# EAGLE design Solar board (EAGLE 9.6.2)
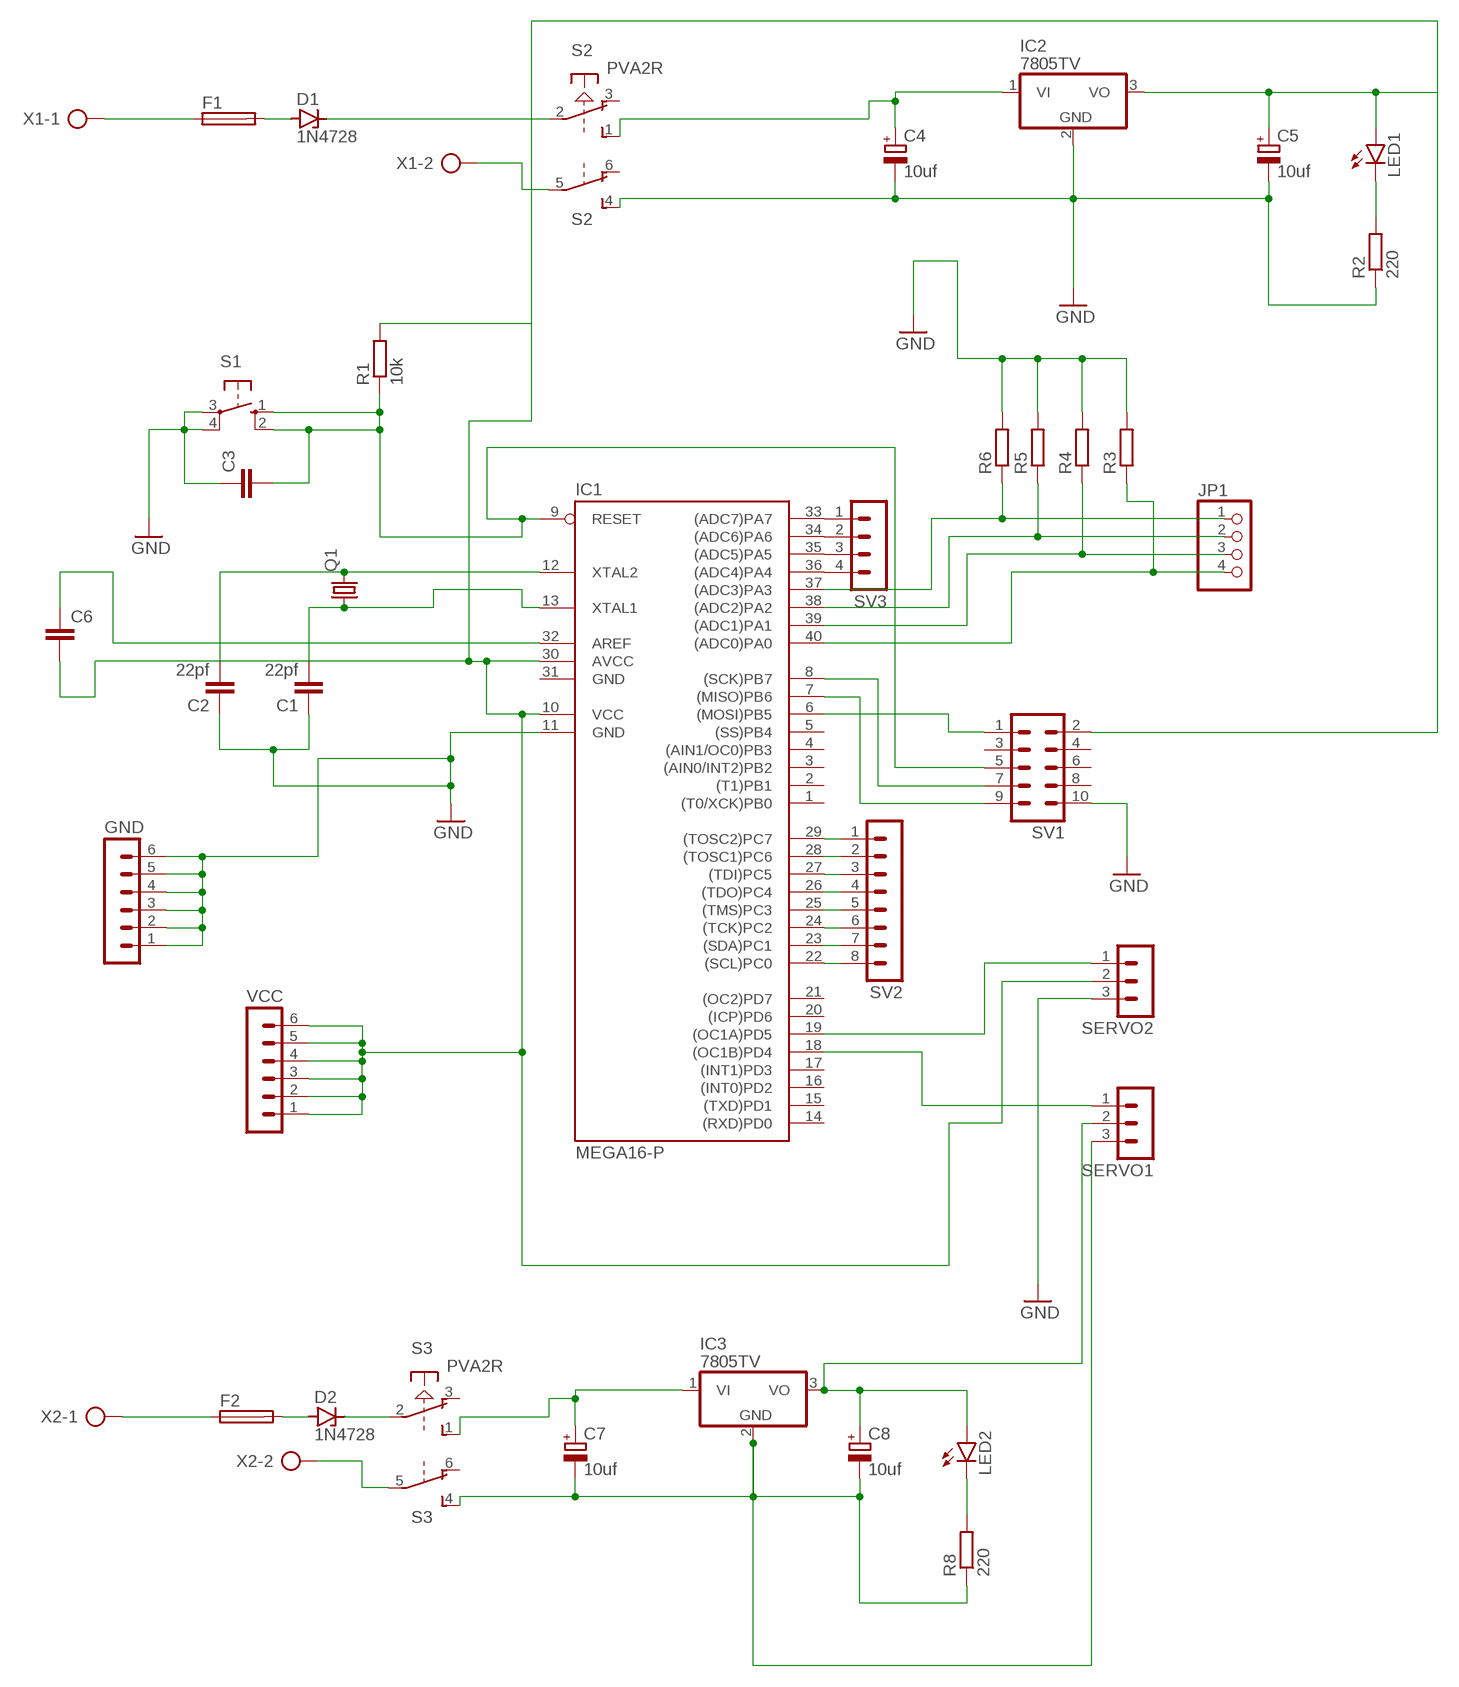
[diagram p0: schematic, sheet 1]

## Parts
C1  22pf  C-EU025-025X050  [C025-025X050]
C2  22pf  C-EU025-025X050  [C025-025X050]
C3  C-EU025-025X050  [C025-025X050]
C4  10uf  CPOL-EUE2.5-6  [E2,5-6]
C5  10uf  CPOL-EUE2.5-6  [E2,5-6]
C6  C-EU025-025X050  [C025-025X050]
C7  10uf  CPOL-EUE2.5-6  [E2,5-6]
C8  10uf  CPOL-EUE2.5-6  [E2,5-6]
D1  1N4728  [DO41Z10]
D2  1N4728  [DO41Z10]
F1  GSH15  [GSH15]
F2  GSH15  [GSH15]
GND  MA06-1  [MA06-1]
IC1  MEGA16-P  [DIL40]
IC2  7805TV  [TO220V]
IC3  7805TV  [TO220V]
JP1  PINHD-1X4  [1X04]
LED1  LED5MM  [LED5MM]
LED2  LED5MM  [LED5MM]
Q1  CRYSTALHC49U70  [HC49U70]
R1  10k  R-EU_0207/10  [0207/10]
R2  220  R-EU_0207/10  [0207/10]
R3  R-EU_0207/10  [0207/10]
R4  R-EU_0207/10  [0207/10]
R5  R-EU_0207/10  [0207/10]
R6  R-EU_0207/10  [0207/10]
R8  220  R-EU_0207/10  [0207/10]
S1  10-XX  [B3F-10XX]
S2  PVA2R  [PVA2R]
S3  PVA2R  [PVA2R]
SERVO1  MA03-1  [MA03-1]
SERVO2  MA03-1  [MA03-1]
SV1  MA05-2  [MA05-2]
SV2  MA08-1W  [MA08-1W]
SV3  MA04-1  [MA04-1]
VCC  MA06-1  [MA06-1]
X1  AK500/2  [AK500/2]
X2  AK500/2  [AK500/2]

## Nets
GND: C1.1 C2.1 C3.1 C4.- C5.- GND.1 GND.2 GND.3 GND.4 GND.5 GND.6 IC1.11(GND) IC2.2(GND) R2.1 R3.2 R4.2 R5.2 R6.2 S1.3(P) S1.4(P1) S2.4(2:S) SERVO2.3 SV1.10
N$1: C1.2 IC1.13(XTAL1) Q1.1
N$2: C2.2 IC1.12(XTAL2) Q1.2
N$3: IC1.6((MOSI)PB5) SV1.1
N$4: IC1.7((MISO)PB6) SV1.9
N$5: IC1.8((SCK)PB7) SV1.7
N$6: C4.+ IC2.1(VI) S2.1(1:S)
N$7: IC1.18((OC1B)PD4) SERVO1.1
N$8: C3.2 IC1.9(RESET) R1.1 S1.1(S) S1.2(S1) SV1.5
N$9: LED1.K(C) R2.2
N$10: IC1.37((ADC3)PA3) JP1.1 R6.1
N$11: IC1.38((ADC2)PA2) JP1.2 R5.1
N$12: IC1.39((ADC1)PA1) JP1.3 R4.1
N$13: IC1.40((ADC0)PA0) JP1.4 R3.1
N$14: IC1.19((OC1A)PD5) SERVO2.1
N$15: D1.A F1.2
N$16: F1.1 X1.1
N$17: D1.C S2.2(1:P)
N$18: LED2.K(C) R8.2
N$19: S2.5(2:P) X1.2
N$20: IC1.29((TOSC2)PC7) SV2.1
N$21: IC1.28((TOSC1)PC6) SV2.2
N$22: IC1.27((TDI)PC5) SV2.3
N$23: IC1.26((TDO)PC4) SV2.4
N$24: IC1.25((TMS)PC3) SV2.5
N$25: IC1.24((TCK)PC2) SV2.6
N$26: IC1.23((SDA)PC1) SV2.7
N$27: IC1.22((SCL)PC0) SV2.8
N$28: IC1.33((ADC7)PA7) SV3.1
N$29: IC1.34((ADC6)PA6) SV3.2
N$30: IC1.35((ADC5)PA5) SV3.3
N$31: IC1.36((ADC4)PA4) SV3.4
N$32: C7.+ IC3.1(VI) S3.1(1:S)
N$33: C6.1 IC1.32(AREF)
N$34: C8.+ IC3.3(VO) LED2.A SERVO1.2
N$35: S3.5(2:P) X2.2
N$37: D2.A F2.2
N$38: F2.1 X2.1
N$39: D2.C S3.2(1:P)
N$40: C7.- C8.- IC3.2(GND) R8.1 S3.4(2:S) SERVO1.3
N$41: C5.+ C6.2 IC1.10(VCC) IC1.30(AVCC) IC2.3(VO) LED1.A R1.2 SERVO2.2 SV1.2 VCC.1 VCC.2 VCC.3 VCC.4 VCC.5 VCC.6
Unconnected: IC1.1((T0/XCK)PB0) IC1.2((T1)PB1) IC1.3((AIN0/INT2)PB2) IC1.4((AIN1/OC0)PB3) IC1.5((SS)PB4) IC1.14((RXD)PD0) IC1.15((TXD)PD1) IC1.16((INT0)PD2) IC1.17((INT1)PD3) IC1.20((ICP)PD6) IC1.21((OC2)PD7) S2.3(1:O) S2.6(2:O) S3.3(1:O) S3.6(2:O) SV1.3 SV1.4 SV1.6 SV1.8

## Power pins joined to a net without a drawn wire
GND: IC1.31(GND)

## Library data of the parts
C1-C3 C6 = rcl:C-EU: CAPACITOR, European symbol; SPICEPREFIX: C
C4 C5 C7 C8 = rcl:CPOL-EU: POLARIZED CAPACITOR, European symbol; SPICEPREFIX: C
D1 D2 = diode:1N4728: Z DIODE 3.3 V, 1W, 5 percent
F1 F2 = fuse:GSH15: FUSE HOLDER grid 15mm, 19649 Wickmann; MPN: 64900001039; OC_FARNELL: 1271673; OC_NEWARK: 02P0318
GND VCC = con-lstb:MA06-1: PIN HEADER; OC_FARNELL: unknown; OC_NEWARK: unknown
IC1 = atmel:MEGA16-P: MICROCONTROLLER 16 Kbytes FLASH 1 kbytes SRAM 512 bytes EEPROM USART 8-channel 10 bit ADC Source: avr.lbr; MPN: ATMEGA16-16PU; OC_FARNELL: 9171142; OC_NEWARK: 01M6885
IC2 IC3 = linear:78*: Positive VOLTAGE REGULATOR Source: http://cache.national.com/ds/LM/LM78L05.pdf http://www.fairchildsemi.com/ds/LM/LM7805.pdf
JP1 = pinhead:PINHD-1X4: PIN HEADER
LED1 LED2 = led:LED: LED OSRAM: - CHIPLED LG R971, LG N971, LY N971, LG Q971, LY Q971, LO R971, LY R971 LH N974, LH R974 LS Q976, LO Q976, LY Q976 LO Q996 - Hyper CHIPLED LW Q18S LB Q993, LB Q99A, LB R99A - SideLED LS A670, LO A670, LY A670, LG A670, LP A670 LB A673, LV A673, LT A673, LW A673 LH A674 LY A675 LS A676, LA A676, LO A676, LY A676, LW A676 LS A679, LY A679, LG A679 - Hyper Micro SIDELED® LS Y876, LA Y876, LO Y876, LY Y876 LT Y87S - SmartLED LW L88C, LW L88S LB L89C, LB L89S, LG L890 LS L89K, LO L89K, LY L89K LS L896, LA L896, LO L896, LY L896 - TOPLED LS T670, LO T670, LY T670, LG T670, LP T670 LSG T670, LSP T670, LSY T670, LOP T670, LYG T670 LG T671, LOG T671, LSG T671 LB T673, LV T673, LT T673, LW T673 LH T674 LS T676, LA T676, LO T676, LY T676, LB T676, LH T676, LSB T676, LW T676 LB T67C, LV T67C, LT T67C, LS T67K, LO T67K, LY T67K, LW E67C LS E67B, LA E67B, LO E67B, LY E67B, LB E67C, LV E67C, LT E67C LW T67C LS T679, LY T679, LG T679 LS T770, LO T770, LY T770, LG T770, LP T770 LB T773, LV T773, LT T773, LW T773 LH T774 LS E675, LA E675, LY E675, LS T675 LS T776, LA T776, LO T776, LY T776, LB T776 LHGB T686 LT T68C, LB T68C - Hyper Mini TOPLED® LB M676 - Mini TOPLED Santana® LG M470 LS M47K, LO M47K, LY M47K Source: http://www.osram.convergy.de LUXEON: - LUMILED® LXK2-PW12-R00, LXK2-PW12-S00, LXK2-PW14-U00, LXK2-PW14-V00 LXK2-PM12-R00, LXK2-PM12-S00, LXK2-PM14-U00 LXK2-PE12-Q00, LXK2-PE12-R00, LXK2-PE12-S00, LXK2-PE14-T00, LXK2-PE14-U00 LXK2-PB12-K00, LXK2-PB12-L00, LXK2-PB12-M00, LXK2-PB14-N00, LXK2-PB14-P00, LXK2-PB14-Q00 LXK2-PR12-L00, LXK2-PR12-M00, LXK2-PR14-Q00, LXK2-PR14-R00 LXK2-PD12-Q00, LXK2-PD12-R00, LXK2-PD12-S00 LXK2-PH12-R00, LXK2-PH12-S00 LXK2-PL12-P00, LXK2-PL12-Q00, LXK2-PL12-R00 Source: www.luxeon.com KINGBRIGHT: KA-3528ASYC Source: www.kingbright.com
Q1 = crystal:CRYSTAL: CRYSTAL; OC_FARNELL: unknown; OC_NEWARK: unknown
R1-R6 R8 = rcl:R-EU_: RESISTOR, European symbol; SPICEPREFIX: R
S1 = switch-omron:10-XX: OMRON SWITCH; MPN: B3F-1000; OC_FARNELL: 176432; OC_NEWARK: 36M3542
S2 S3 = switch-misc:PVA2R: ITT SWITCH
SERVO1 SERVO2 = con-lstb:MA03-1: PIN HEADER; OC_FARNELL: unknown; OC_NEWARK: unknown
SV1 = con-lstb:MA05-2: PIN HEADER; OC_FARNELL: unknown; OC_NEWARK: unknown
SV2 = con-lstb:MA08-1W: PIN HEADER; OC_FARNELL: unknown; OC_NEWARK: unknown
SV3 = con-lstb:MA04-1: PIN HEADER; OC_FARNELL: unknown; OC_NEWARK: unknown
X1 X2 = con-ptr500:AK500/2: CONNECTOR; OC_FARNELL: unknown; OC_NEWARK: unknown

## Board
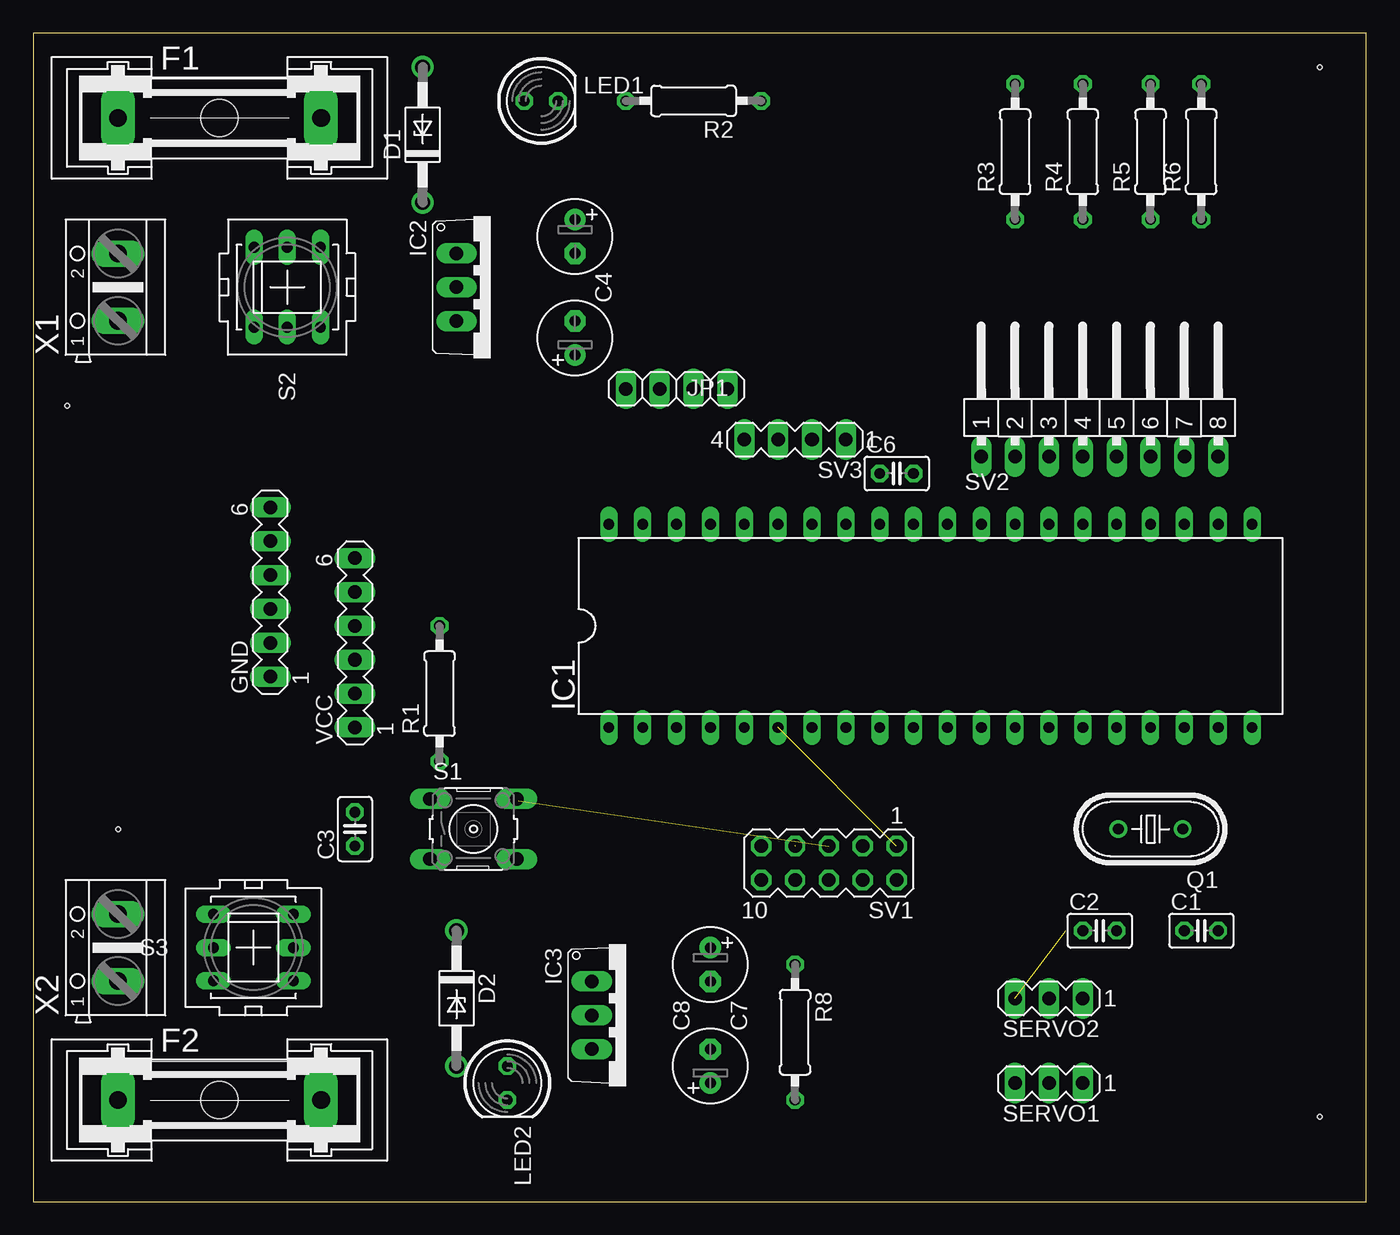
[diagram p1: board, top side]
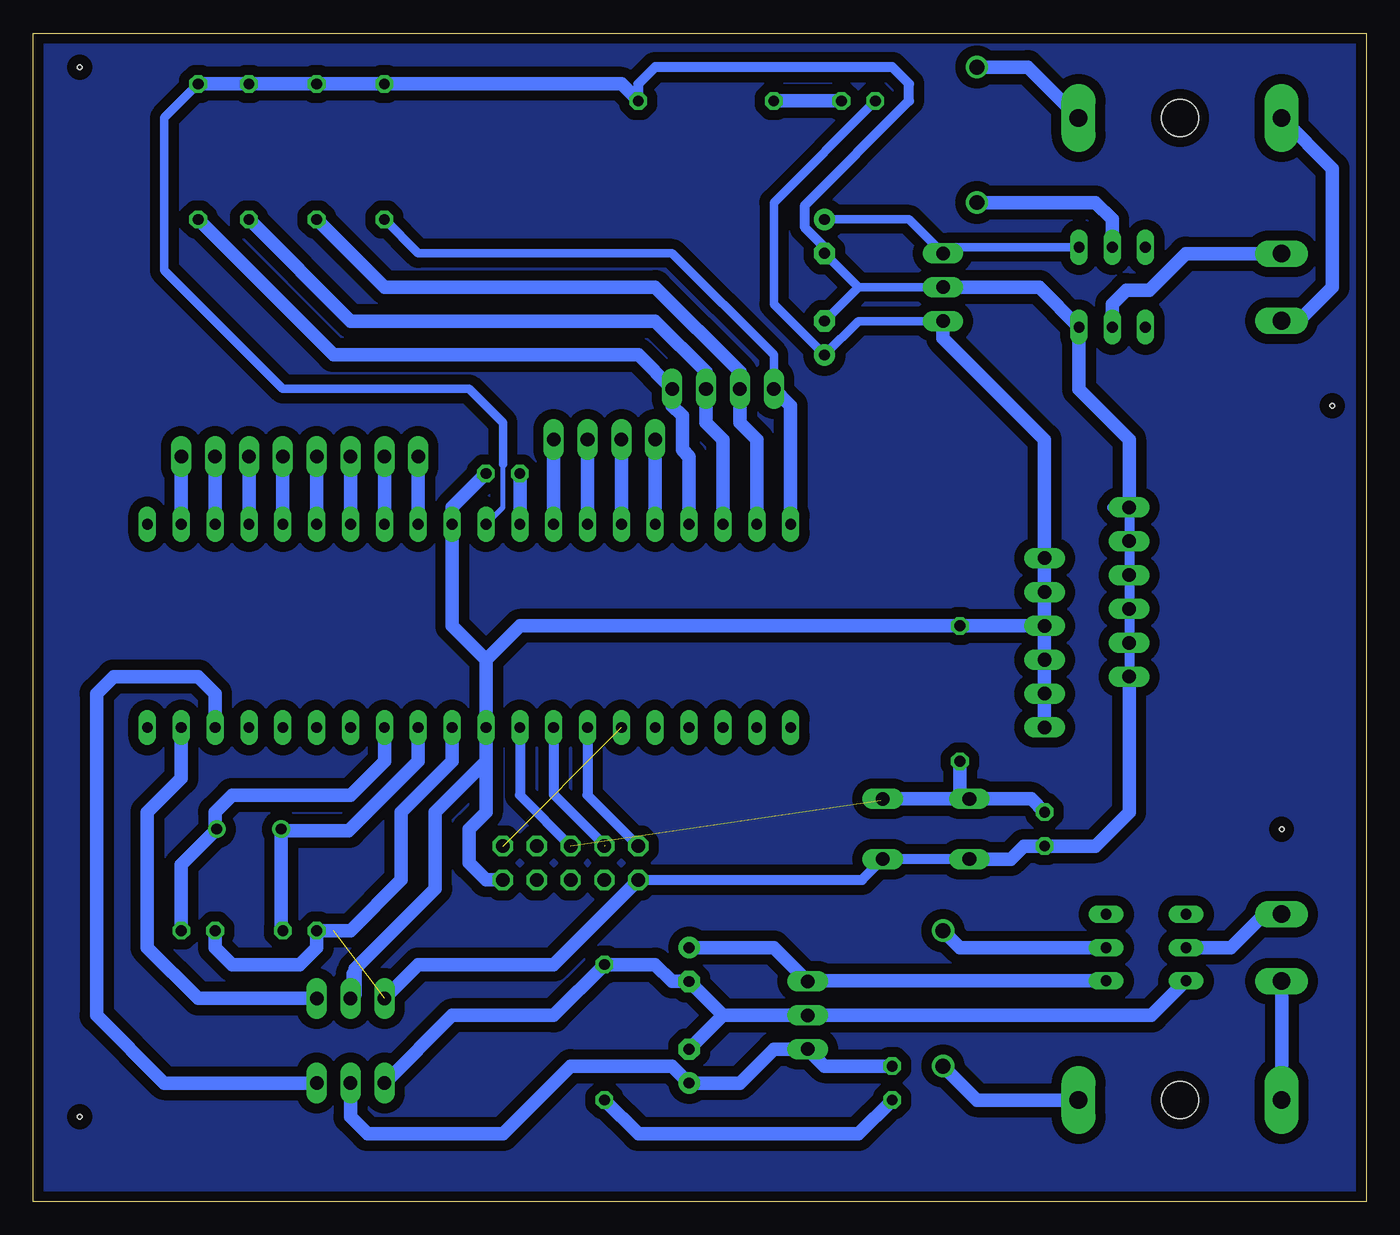
[diagram p2: board, bottom side, seen from below]

Size 100 x 87.62 mm. Coordinates in mm from the lower left corner, seen from the top.
Outline: 0,0 100,0 100,87.62 0,87.62 0,0
Copper layers (1*16): Top 0.035mm / dielectric 1.5mm / Bottom 0.035mm
Design rules "default *": minimum track width 40mil, minimum drill 0.35mm, track to track 30mil, track to pad 30mil, pad to pad 20mil, via to via 6mil, smd to smd 6mil, copper to edge 30mil, drill to drill 10mil, minimum pad ring 10mil, minimum via ring 8mil, stop-mask expansion 4mil, vias tented up to drill 0mil, thermal gap 10mil
Holes 0.35 mm at 96.52,85.09 2.54,59.69 6.35,27.94 96.52,6.35

### Footprints (pad centres in the part's own frame; a part is rotated, then mirrored left to right if it is on the bottom)
C025-025X050 = drill 0.813 octagon: 1 -1.27,0; 2 1.27,0
E2,5-6 = drill 0.813 pad 1.6: + -1.27,0 | drill 0.813 pad 1.6 octagon: - 1.27,0
DO41Z10 = drill 1.118: A 5.08,0; C -5.08,0
GSH15 = drill 1.321 pad 2.54 long: 1 -7.62,0; 2 7.62,0 | hole 2.794: 0,0
MA06-1 = drill 1.016 long: 1 -6.35,0; 2 -3.81,0; 3 -1.27,0; 4 1.27,0; 5 3.81,0; 6 6.35,0
DIL40 = drill 0.813 long: 1 -24.13,-7.62; 2 -21.59,-7.62; 3 -19.05,-7.62; 4 -16.51,-7.62; 5 -13.97,-7.62; 6 -11.43,-7.62; 7 -8.89,-7.62; 8 -6.35,-7.62; 9 -3.81,-7.62; 10 -1.27,-7.62; 11 1.27,-7.62; 12 3.81,-7.62; 13 6.35,-7.62; 14 8.89,-7.62; 15 11.43,-7.62; 16 13.97,-7.62; 17 16.51,-7.62; 18 19.05,-7.62; 19 21.59,-7.62; 20 24.13,-7.62; 21 24.13,7.62; 22 21.59,7.62; 23 19.05,7.62; 24 16.51,7.62; 25 13.97,7.62; 26 11.43,7.62; 27 8.89,7.62; 28 6.35,7.62; 29 3.81,7.62; 30 1.27,7.62; 31 -1.27,7.62; 32 -3.81,7.62; 33 -6.35,7.62; 34 -8.89,7.62; 35 -11.43,7.62; 36 -13.97,7.62; 37 -16.51,7.62; 38 -19.05,7.62; 39 -21.59,7.62; 40 -24.13,7.62
TO220V = drill 1.016 long: 1 -2.54,-2.54; 2 0,-2.54; 3 2.54,-2.54
1X04 = drill 1.016 long: 1 -3.81,0; 2 -1.27,0; 3 1.27,0; 4 3.81,0
LED5MM = drill 0.813 octagon: A -1.27,0; K 1.27,0
HC49U70 = drill 0.813: 1 -2.413,0; 2 2.413,0
0207/10 = drill 0.813 octagon: 1 -5.08,0; 2 5.08,0
B3F-10XX = drill 1.016 long: 1 -3.251,2.261; 2 3.251,2.261; 3 -3.251,-2.261; 4 3.251,-2.261
PVA2R = drill 0.813 long: 1 -2.997,2.489; 2 -2.997,0; 3 -2.997,-2.489; 4 2.997,2.489; 5 2.997,0; 6 2.997,-2.489
MA03-1 = drill 1.016 long: 1 -2.54,0; 2 0,0; 3 2.54,0
MA05-2 = drill 1.016 octagon: 1 -5.08,-1.27; 2 -5.08,1.27; 3 -2.54,-1.27; 4 -2.54,1.27; 5 0,-1.27; 6 0,1.27; 7 2.54,-1.27; 8 2.54,1.27; 9 5.08,-1.27; 10 5.08,1.27
MA08-1W = drill 1.016 long: 1 -8.89,0; 2 -6.35,0; 3 -3.81,0; 4 -1.27,0; 5 1.27,0; 6 3.81,0; 7 6.35,0; 8 8.89,0
MA04-1 = drill 1.016 long: 1 -3.81,0; 2 -1.27,0; 3 1.27,0; 4 3.81,0
AK500/2 = drill 1.321 long: 1 -2.515,0; 2 2.515,0

### Placement (x,y rotation side)
C1  87.63,20.32 0 top
C2  80.01,20.32 0 top
C3  24.13,27.94 90 top
C4  40.64,72.39 270 top
C5  40.64,64.77 90 top
C6  64.77,54.61 0 top
C7  50.8,17.78 270 top
C8  50.8,10.16 90 top
D1  29.21,80.01 90 top
D2  31.75,15.24 270 top
F1  13.97,81.28 0 top
F2  13.97,7.62 0 top
GND  17.78,45.72 90 top
IC1  67.31,43.18 0 top
IC2  34.29,68.58 270 top
IC3  44.45,13.97 270 top
JP1  48.26,60.96 180 top
LED1  38.1,82.55 0 top
LED2  35.56,8.89 270 top
Q1  83.82,27.94 180 top
R1  30.48,38.1 90 top
R2  49.53,82.55 180 top
R3  73.66,78.74 90 top
R4  78.74,78.74 90 top
R5  83.82,78.74 90 top
R6  87.63,78.74 90 top
R8  57.15,12.7 270 top
S1  33.02,27.94 0 top
S2  19.05,68.58 270 top
S3  16.51,19.05 180 top
SERVO1  76.2,8.89 180 top
SERVO2  76.2,15.24 180 top
SV1  59.69,25.4 180 top
SV2  80.01,55.88 0 top
SV3  57.15,57.15 180 top
VCC  24.13,41.91 90 top
X1  6.35,68.58 90 top
X2  6.35,19.05 90 top

### Tracks (layer width: path | path; a pad name or v marks a point on that pad's centre or on a via)
22
  pour Bottom: 0,0 100.33,0 100.33,87.63 0,87.63
GND  (1 unrouted)
  Bottom 0.254: GND.6 GND.5 GND.4 GND.3 GND.2 GND.1
  Bottom 0.381: IC1.31 64.77,52.07 64.77,55.88 | 73.66,13.97 SERVO2.3 | 36.69,25.26 S1.4
  Bottom 0.635: 77.47,20.32 C2.1 | IC2.2 38.1,68.58 | C5.- 38.1,68.58 | 38.1,68.58 C4.- | R6.2 90.17,81.28 90.17,69.85 81.28,60.96 67.31,60.96 64.77,58.42 64.77,55.88 64.77,55.32
  Bottom 0.762: C4.- 40.64,71.59 42.1,73.06 42.1,74.74 34.29,82.55 34.29,83.82 35.56,85.09 53.34,85.09 54.61,83.82 R2.1 | GND.1 GND.6 19.05,52.07 | S1.3 S1.4 | SV1.10 37.82,24.13 36.69,25.26
  Bottom 1.016: IC2.2 24.54,68.58 S2.4 21.54,60.91 17.78,57.15 GND.6 | R2.1 55.88,83.82 R3.2 R4.2 R5.2 R6.2 | IC1.11 68.58,33.02 72.39,29.21 72.39,24.13 76.2,20.32 C2.1 78.74,19.05 80.01,17.78 85.09,17.78 86.36,19.05 C1.1 | SV1.10 60.96,17.78 71.12,17.78 SERVO2.3 | GND.1 17.78,29.21 20.32,26.67 C3.1 25.68,26.67 26.67,25.68 S1.3
N$1
  Bottom 0.254: 86.36,27.94 Q1.1
  Bottom 1.016: IC1.13 73.66,33.02 76.2,30.48 85.09,30.48 86.36,29.21 86.36,27.94 | Q1.1 88.9,25.27 C1.2
N$2
  Bottom 1.016: IC1.12 71.12,33.02 76.33,27.81 81.28,27.81 Q1.2 81.41,20.45 C2.2
N$3  (1 unrouted)
N$4
  Bottom 0.381: SV1.9 58.42,30.48
  Bottom 0.762: IC1.7 58.42,30.48 54.67,26.73 54.61,26.73
N$5  (1 unrouted)
  Bottom 0.762: IC1.8 60.96,30.54 57.15,26.73
N$6
  Bottom 0.254: IC2.1 33.02,71.12
  Bottom 0.635: S2.1 31.29,71.58 IC2.1 34.29,73.66 C4.+
N$7
  Bottom 1.016: IC1.18 86.36,38.1 87.63,39.37 93.98,39.37 95.25,38.1 95.25,13.97 90.17,8.89 SERVO1.1
N$8  (1 unrouted)
  Bottom 0.254: 29.21,30.2 S1.1 30.48,30.2
  Bottom 0.762: IC1.9 63.5,30.48 SV1.5 | C3.2 24.98,30.06 30.48,30.06 36.41,30.06 | S1.1 30.48,30.91 R1.1
  Bottom 1.016: C3.2 25.12,30.2 29.21,30.2 30.48,30.2 S1.2 | R1.1 30.48,30.06
N$9
  Bottom 1.016: R2.2 LED1.K
N$10
  Bottom 1.016: R6.1 77.47,63.5 54.61,63.5 JP1.1 52.07,59.69 51.31,58.93 51.31,56.39 50.8,55.88 IC1.37
N$11
  Bottom 1.016: R5.1 76.2,66.04 53.34,66.04 49.53,62.23 JP1.2 49.53,58.42 48.26,57.15 IC1.38
N$12
  Bottom 1.016: R4.1 73.66,68.58 53.34,68.58 46.99,62.23 JP1.3 46.99,58.42 45.72,57.15 IC1.39
N$13
  Bottom 0.254: JP1.4 44.45,62.23
  Bottom 0.635: JP1.4 44.45,63.5 52.07,71.12 71.12,71.12 R3.1
  Bottom 1.016: JP1.4 43.18,59.69 IC1.40
N$14
  Bottom 1.016: IC1.19 88.9,31.75 91.44,29.21 91.44,19.05 87.63,15.24 SERVO2.1
N$15
  Bottom 1.016: D1.A 25.4,85.09 F1.2
N$16
  Bottom 1.016: F1.1 2.54,77.47 2.54,68.58 5.05,66.06 X1.1
N$17
  Bottom 1.016: S2.2 19.05,73.66 20.32,74.93 D1.C
N$18
  Bottom 1.016: R8.2 54.61,5.08 38.1,5.08 LED2.K
N$19
  Bottom 1.016: X1.2 13.54,71.09 16.28,68.35 18.01,68.35 19.05,67.31 S2.5
N$20
  Bottom 1.016: SV2.1 IC1.29
N$21
  Bottom 1.016: SV2.2 IC1.28
N$22
  Bottom 1.016: SV2.3 IC1.27
N$23
  Bottom 1.016: SV2.4 IC1.26
N$24
  Bottom 1.016: SV2.5 IC1.25
N$25
  Bottom 1.016: SV2.6 IC1.24
N$26
  Bottom 1.016: SV2.7 IC1.23
N$27
  Bottom 1.016: SV2.8 IC1.22
N$28
  Bottom 1.016: SV3.1 IC1.33
N$29
  Bottom 1.016: SV3.2 IC1.34
N$30
  Bottom 1.016: SV3.3 IC1.35
N$31
  Bottom 1.016: SV3.4 IC1.36
N$32
  Bottom 0.635: 41.86,16.56 IC3.1
  Bottom 1.016: S3.1 41.86,16.56 | IC3.1 44.45,19.05 C7.+
N$33
  Bottom 1.016: C6.1 IC1.32
N$34
  Bottom 1.016: LED2.A 40.64,10.16 IC3.3 44.45,11.43 46.99,8.89 C8.+ 52.07,10.16 59.69,10.16 64.77,5.08 74.93,5.08 76.2,6.35 SERVO1.2
N$35
  Bottom 1.016: X2.2 7.64,21.57 10.16,19.05 S3.5
N$37
  Bottom 1.016: D2.A 29.21,7.62 F2.2
N$38
  Bottom 1.016: X2.1 F2.1
N$39
  Bottom 1.016: S3.2 30.48,19.05 D2.C
N$40
  Bottom 1.016: S3.4 16.1,13.97 IC3.2 48.26,13.97 | 48.26,13.97 C7.- 52.07,16.51 53.34,17.78 R8.1 60.96,13.97 68.58,13.97 SERVO1.3 | 48.26,13.97 C8.-
N$41
  Bottom 0.635: 75.88,17.46 76.2,17.13 SERVO2.2 | IC2.3 38.1,66.04 C5.+ 44.45,67.31 44.45,74.93 LED1.A
  Bottom 1.016: C6.2 68.58,52.07 IC1.30 68.58,43.18 66.04,40.64 | 66.04,40.64 IC1.10 66.04,33.02 | 66.04,40.64 63.5,43.18 R1.2 VCC.4 | SV1.2 66.04,24.13 67.31,25.4 67.31,27.94 66.04,29.21 66.04,33.02 | SERVO2.2 75.88,15.57 75.88,17.46 69.85,23.48 69.85,29.21 66.04,33.02 | IC2.3 31.75,64.77 24.13,57.15 VCC.6 VCC.5 VCC.4 | VCC.1 VCC.2 VCC.3 VCC.4